# Altium schematic sheet 1_P1.schdoc
size 309 x 223 mm; Symbol: Sheet-Symbol_A4; Device: Sheet-Symbol_A4; Company: 嘉立创EDA; Version: V1.0; Page Size: A4; @Project Name: wheel_robot; @Page Count: 1; @Update Date: 2025-04-28; @Create Date: 2024-12-27; @Schematic Name: Schematic2; @Page No: 1; @Page Name: P1; @Board Name: IMU_ESP8266; @Create Time: 16:52:50; @Update Time: 16:48:46
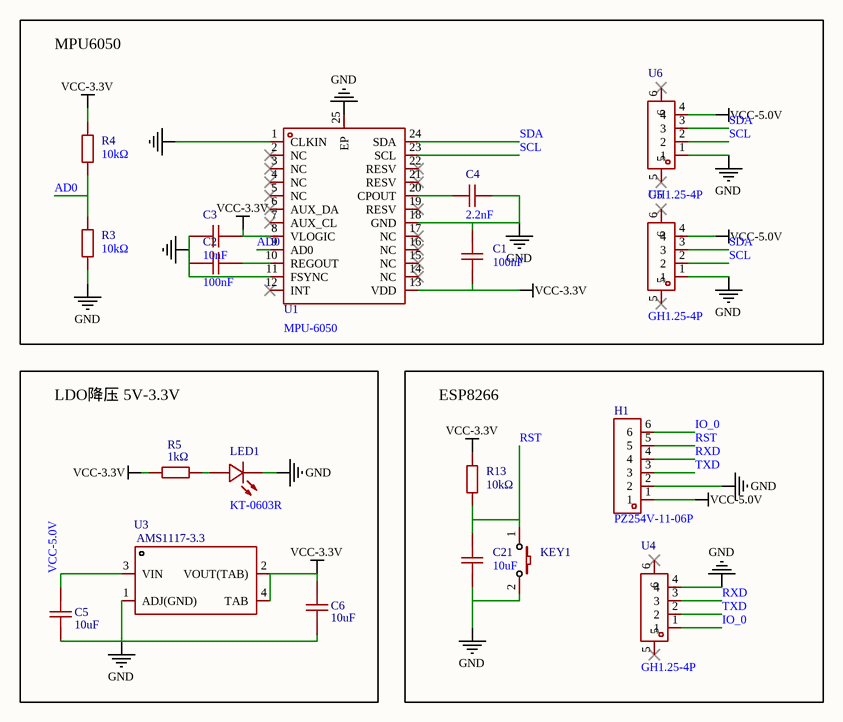
[diagram p0: 1_P1.schdoc]

## Parts
C1  100nF  [C0603]
C2  100nF  [C0603]
C3  10nF  [C0603]
C4  2.2nF  [C0603]
C5  10uF  [C0603]
C6  10uF  [C0603]
C21  10uF  [C0603]
H1  PZ254V-11-06P  [HDR-TH_6P-P2.54-V-M]
KEY1  K2-3.6×6.1_SMD  [KEY-SMD_2P-L6.2-W3.6-LS8.0]  (value not drawn)
LED1  KT-0603R  [LED0603-RD]
R3  10kΩ  [R0603]
R4  10kΩ  [R0603]
R5  1kΩ  [R0603]
R13  10kΩ  [R0603]
U1  MPU-6050  [QFN-24_L4.0-W4.0-P0.50-BL-EP2.7]
U3  AMS1117-3.3  [SOT-223_L6.7-W3.5-P2.30-BR]
U4  GH1.25-4P  [CONN-SMD_GH1.25-4P]
U5  GH1.25-4P  [CONN-SMD_GH1.25-4P]
U6  GH1.25-4P  [CONN-SMD_GH1.25-4P]

## Blocks framed on the sheet
MPU6050: C1-C4 R3 R4 U1 U5 U6
LDO降压 5V-3.3V: C5 C6 LED1 R5 U3
ESP8266: C21 H1 KEY1 R13 U4

## Nets
GND: C1.2 C2.2 C3.1 C4.2 C5.1 C6.1 C21.2 H1.2 KEY1.2 LED1.1(K) R3.1 U1.1(CLKIN) U1.11(FSYNC) U1.18(GND) U1.25(EP) U3.1(ADJ(GND)) U4.4 U5.1 U6.1
VCC-3.3V: C1.1 C3.2 C6.2 R4.2 R5.1 R13.2 U1.8(VLOGIC) U1.13(VDD) U3.2(VOUT(TAB)) U3.4(TAB)
VCC-5.0V: C5.2 H1.1 U3.3(VIN) U5.4 U6.4
AD0: R3.2 R4.1 U1.9(AD0)
IO_0: H1.6 U4.1
RST: C21.1 H1.5 KEY1.1 R13.1
RXD: H1.4 U4.3
SCL: U1.23(SCL) U5.2 U6.2
SDA: U1.24(SDA) U5.3 U6.3
TXD: H1.3 U4.2
NetC2_1: C2.1 U1.10(REGOUT)
NetC4_1: C4.1 U1.20(CPOUT)
NetLED1_2: LED1.2(A) R5.2

Not connected (* = marked no-connect by the designer): U1 2(NC)* 3(NC)* 4(NC)* 5(NC)* 6(AUX_DA)* 7(AUX_CL)* 12(INT)* 14(NC)* 15(NC)* 16(NC)* 17(NC)* 19(RESV)* 21(RESV)* 22(RESV)*; U4 5* 6*; U5 5* 6*; U6 5* 6*

## Notes on the sheet
- 1
- 2
- 3
- 4
- 5
- 6
- A
- B
- C
- 原理图
- Schematic2
- 创建日期
- 更新日期
- 2025-04-28
- 2024-12-27
- 审阅
- 绘制
- 图页
- P1
- 物料编码
- wheel_robot
- D
- 版本
- 尺寸
- 页
- 共
- V1.0
- A4
- 嘉立创EDA

## Library data of the parts
C1 = CGA0603X7R104K500JT: Manufacturer: HRE(芯声); Symbol: CGA0805X7R104K500KT; Add into BOM: yes; Tolerance: ±10%; Voltage Rated: 50V; Temperature Coefficient: X7R; Channel ID: $1e1163; Device: CGA0603X7R104K500JT; LCSC Part Name: 100nF ±10% 50V; Supplier Part: C6119867; Manufacturer Part: CGA0603X7R104K500JT; Supplier Footprint: 0603; JLCPCB Part Class: Extended Part; Supplier: LCSC; Convert to PCB: yes; Value: 100nF; FootprintName: C0603; DeviceName: CGA0603X7R104K500JT
C2 = CGA0603X7R104K500JT: Manufacturer: HRE(芯声); Symbol: CGA0805X7R104K500KT; Add into BOM: yes; Tolerance: ±10%; Voltage Rated: 50V; Temperature Coefficient: X7R; Channel ID: $1e1262; Device: CGA0603X7R104K500JT; LCSC Part Name: 100nF ±10% 50V; Supplier Part: C6119867; Manufacturer Part: CGA0603X7R104K500JT; Supplier Footprint: 0603; JLCPCB Part Class: Extended Part; Supplier: LCSC; Convert to PCB: yes; Value: 100nF; FootprintName: C0603; DeviceName: CGA0603X7R104K500JT
C3 = CC0603KRX7R9BB103: Manufacturer: YAGEO(国巨); Symbol: CC0805KRX7R9BB103; Add into BOM: yes; Tolerance: ±10%; Voltage Rated: 50V; Temperature Coefficient: X7R; Channel ID: $1e1350; Device: CC0603KRX7R9BB103; LCSC Part Name: 10nF ±10% 50V; Supplier Part: C100042; Manufacturer Part: CC0603KRX7R9BB103; Supplier Footprint: 0603; JLCPCB Part Class: Extended Part; Datasheet: https://atta.szlcsc.com/upload/public/pdf/source/20181008/C309510_22F155564471FAF6A489F7D68F34234E.pdf; Supplier: LCSC; Convert to PCB: yes; Value: 10nF; FootprintName: C0603; DeviceName: CC0603KRX7R9BB103
C4 = CC0603KRX7R9BB222: Manufacturer: YAGEO(国巨); Symbol: CL21C222JBFNNNE; Add into BOM: yes; Tolerance: ±10%; Voltage Rated: 50V; Temperature Coefficient: X7R; Channel ID: $1e1549; Device: CC0603KRX7R9BB222; LCSC Part Name: 2.2nF ±10% 50V; Supplier Part: C107082; Manufacturer Part: CC0603KRX7R9BB222; Supplier Footprint: 0603; JLCPCB Part Class: Extended Part; Datasheet: https://atta.szlcsc.com/upload/public/pdf/source/20180910/C282072_33301C7F631E79921B82A8DAC6BCC5B3.pdf; Supplier: LCSC; Convert to PCB: yes; Value: 2.2nF; FootprintName: C0603; DeviceName: CC0603KRX7R9BB222
C5 = CGA0603X5R106K100JT: Manufacturer: HRE(芯声); Add into BOM: yes; Tolerance: ±10%; Voltage Rated: 10V; Temperature Coefficient: X5R; Channel ID: $1e2565; Symbol: 10uF; Device: CGA0603X5R106K100JT; LCSC Part Name: 10uF ±10% 10V; Supplier Part: C6119842; Manufacturer Part: CGA0603X5R106K100JT; Supplier Footprint: 0603; JLCPCB Part Class: Extended Part; Supplier: LCSC; Convert to PCB: yes; Value: 10uF; FootprintName: C0603; DeviceName: CGA0603X5R106K100JT
C6 = CGA0603X5R106K100JT: Manufacturer: HRE(芯声); Add into BOM: yes; Tolerance: ±10%; Voltage Rated: 10V; Temperature Coefficient: X5R; Channel ID: $1e2618; Symbol: 10uF; Device: CGA0603X5R106K100JT; LCSC Part Name: 10uF ±10% 10V; Supplier Part: C6119842; Manufacturer Part: CGA0603X5R106K100JT; Supplier Footprint: 0603; JLCPCB Part Class: Extended Part; Supplier: LCSC; Convert to PCB: yes; Value: 10uF; FootprintName: C0603; DeviceName: CGA0603X5R106K100JT
C21 = CGA0603X5R106K100JT: Manufacturer: HRE(芯声); Symbol: CL21A106KAYNNNE; Add into BOM: yes; Tolerance: ±10%; Voltage Rated: 10V; Temperature Coefficient: X5R; Channel ID: $1e2719; Device: CGA0603X5R106K100JT; LCSC Part Name: 10uF ±10% 10V; Supplier Part: C6119842; Manufacturer Part: CGA0603X5R106K100JT; Supplier Footprint: 0603; JLCPCB Part Class: Extended Part; Supplier: LCSC; Convert to PCB: yes; Value: 10uF; FootprintName: C0603; DeviceName: CGA0603X5R106K100JT
H1 = PZ254V-11-06P: Manufacturer: XFCN(兴飞); Add into BOM: yes; Pin Structure: 1x6P; Pitch: 2.54mm; Circluar Pins/Square Pins: 方针; Symbol: PZ254V-11-06P; Device: PZ254V-11-06P; LCSC Part Name: 间距:2.54mm 1x6P 直插 方针; Supplier Part: C492405; Manufacturer Part: PZ254V-11-06P; Supplier Footprint: 插件,P=2.54mm; JLCPCB Part Class: 扩展库; Datasheet: https://atta.szlcsc.com/upload/public/pdf/source/20200309/C492405_597F1930F5B55CC3C7FD95458F1C3977.pdf; Supplier: LCSC; Convert to PCB: yes; Row Spacing: -; Mounting Type: 直插; Number of Rows: 单排; Number of Pins: 6P; Current Rating (Max): -; Voltage Rating (Max): -; Length of Mating Pin: 6mm; Insulation Height: 2.5mm; Length of End Connection Pin: 3mm; Contact Material: 黄铜; Contact Plating: -; Operating Temperature Range: -40℃~+105℃; Color: 黑色
KEY1 = K2-3.6×6.1_SMD: Manufacturer Part: K2-1107ST-A4SW-06; 制造商: 韩国韩荣; Add into BOM: yes; Symbol: K2-3.6×6.1_SMD; Device: K2-3.6×6.1_SMD; Supplier Part: C118141; Supplier: LCSC; Convert to PCB: yes; Origin Footprint: KEY-SMD_2P-L6.2-W3.6-LS8.0
LED1 = KT-0603R: Manufacturer: KENTO; Add into BOM: yes; Emitted Color: 红色; Symbol: KT-0603R; Device: KT-0603R; LCSC Part Name: 0603 红灯 高亮; Supplier Part: C2286; Manufacturer Part: KT-0603R; Supplier Footprint: 0603; JLCPCB Part Class: 基础库; Datasheet: https://atta.szlcsc.com/upload/public/pdf/source/20160616/1466072038404.pdf; Supplier: LCSC; Convert to PCB: yes; Power Dissipation: -; Forward Current: -; Dominant Wavelength: -; Peak Wavelength: -; Diode Configuration: -; Lens Color: -; Color Temperature: -; Viewing Angle: -; Mounting Sytle: -; Operating Temperature: -40℃~+85℃
R3 = 0603WAF1002T5E: Manufacturer: UNI-ROYAL(厚声); Symbol: 0805W8F1002T5E; Add into BOM: yes; Tolerance: ±1%; Power(Watts): 100mW; Overload Voltage (Max): 75V; Temperature Coefficient: ±100ppm/℃; Channel ID: $1e1841; Device: 0603WAF1002T5E; LCSC Part Name: 厚膜电阻 10kΩ ±1% 100mW; Supplier Part: C25804; Manufacturer Part: 0603WAF1002T5E; Supplier Footprint: 0603; JLCPCB Part Class: Basic Part; Datasheet: https://atta.szlcsc.com/upload/public/pdf/source/20200306/C422600_1E6D84923E4A46A82E41ADD87F860B5C.pdf; Supplier: LCSC; Convert to PCB: yes; Type: 厚膜电阻; Value: 10kΩ; Operating Temperature Range: -55℃~+155℃; FootprintName: R0603; DeviceName: 0603WAF1002T5E
R4 = 0603WAF1002T5E: Manufacturer: UNI-ROYAL(厚声); Symbol: 0805W8F1002T5E; Add into BOM: yes; Tolerance: ±1%; Power(Watts): 100mW; Overload Voltage (Max): 75V; Temperature Coefficient: ±100ppm/℃; Channel ID: $1e1891; Device: 0603WAF1002T5E; LCSC Part Name: 厚膜电阻 10kΩ ±1% 100mW; Supplier Part: C25804; Manufacturer Part: 0603WAF1002T5E; Supplier Footprint: 0603; JLCPCB Part Class: Basic Part; Datasheet: https://atta.szlcsc.com/upload/public/pdf/source/20200306/C422600_1E6D84923E4A46A82E41ADD87F860B5C.pdf; Supplier: LCSC; Convert to PCB: yes; Type: 厚膜电阻; Value: 10kΩ; Operating Temperature Range: -55℃~+155℃; FootprintName: R0603; DeviceName: 0603WAF1002T5E
R5 = 0603WAF1001T5E: Manufacturer: UNI-ROYAL(厚声); Symbol: 1K; Add into BOM: yes; Tolerance: ±1%; Power(Watts): 100mW; Overload Voltage (Max): 75V; Temperature Coefficient: ±100ppm/℃; Channel ID: $1e2538; Device: 0603WAF1001T5E; LCSC Part Name: 1kΩ ±1% 100mW 厚膜电阻; Supplier Part: C21190; Manufacturer Part: 0603WAF1001T5E; Supplier Footprint: 0603; JLCPCB Part Class: Basic Part; Datasheet: https://atta.szlcsc.com/upload/public/pdf/source/20200306/C422600_1E6D84923E4A46A82E41ADD87F860B5C.pdf; Supplier: LCSC; Convert to PCB: yes; Type: 厚膜电阻; Value: 1kΩ; Operating Temperature Range: -55℃~+155℃; FootprintName: R0603; DeviceName: 0603WAF1001T5E
R13 = 0603WAF1002T5E: Manufacturer: UNI-ROYAL(厚声); Symbol: 10K; Add into BOM: yes; Tolerance: ±1%; Power(Watts): 100mW; Overload Voltage (Max): 75V; Temperature Coefficient: ±100ppm/℃; Channel ID: $1e2667; Device: 0603WAF1002T5E; LCSC Part Name: 厚膜电阻 10kΩ ±1% 100mW; Supplier Part: C25804; Manufacturer Part: 0603WAF1002T5E; Supplier Footprint: 0603; JLCPCB Part Class: Basic Part; Datasheet: https://atta.szlcsc.com/upload/public/pdf/source/20200306/C422600_1E6D84923E4A46A82E41ADD87F860B5C.pdf; Supplier: LCSC; Convert to PCB: yes; Type: 厚膜电阻; Value: 10kΩ; Operating Temperature Range: -55℃~+155℃; FootprintName: R0603; DeviceName: 0603WAF1002T5E
U1 = MPU-6050: Manufacturer: TDK InvenSense(应美盛); Symbol: MPU-6050_C24112; Add into BOM: yes; Sensor Type: 加速度计陀螺仪; Device: MPU-6050; LCSC Part Name: MPU-6050; Supplier Part: C24112; Manufacturer Part: MPU-6050; Supplier Footprint: QFN-24-EP(4x4); JLCPCB Part Class: 扩展库; Datasheet: https://atta.szlcsc.com/upload/public/pdf/source/20140425/1457707046159.pdf; Supplier: LCSC; Convert to PCB: yes; Operating Temperature: -40℃~+85℃
U3 = AMS1117-3.3: Manufacturer: Youtai Semiconductor Co., Ltd.; Add into BOM: yes; Symbol: AMS1117-3.3; Device: AMS1117-3.3; Supplier: LCSC; Supplier Part: C347222; Manufacturer Part: AMS1117-3.3; JLCPCB Part Class: Extend; Convert to PCB: yes; Origin Footprint: SOT-223_L6.7-W3.5-P2.30-BR
U4-U6 = GH1.25-4P_C9900006327: Add into BOM: yes; Symbol: GH1.25-4P; Device: GH1.25-4P_C9900006327; LCSC Part Name: GH1.25-4P; Supplier Part: C9900006327; Manufacturer Part: GH1.25-4P; Supplier Footprint: GH1.25-4P; JLCPCB Part Class: 扩展库; Supplier: LCSC; Convert to PCB: yes